# Altium schematic sheet M3005.SchDoc
size A4
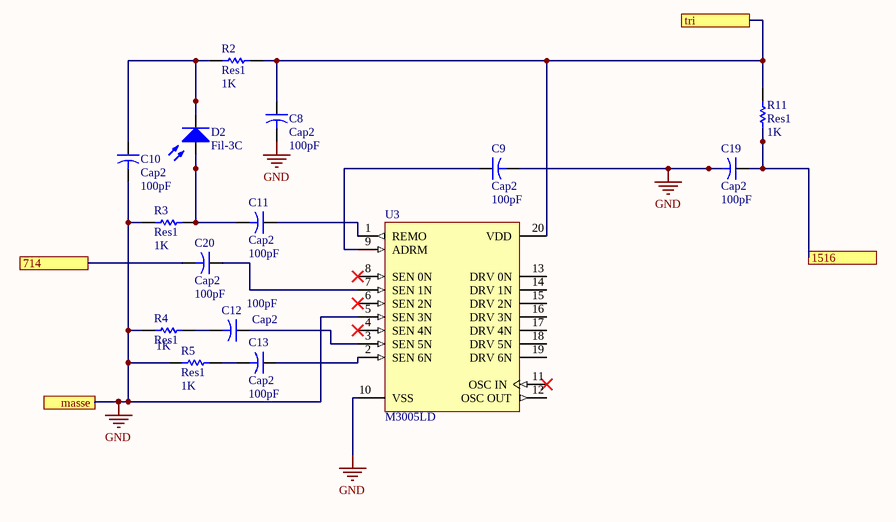
[diagram p0: M3005.SchDoc]

## Parts
C8  Cap2  value 100pF  [RAD-0.2]
C9  Cap2  value 100pF  [RAD-0.2]
C10  Cap2  value 100pF  [RAD-0.2]
C11  Cap2  value 100pF  [RAD-0.2]
C12  Cap2  value 100pF  [RAD-0.2]
C13  Cap2  value 100pF  [RAD-0.2]
C19  Cap2  value 100pF  [RAD-0.2]
C20  Cap2  value 100pF  [RAD-0.2]
D2  Fil-3C  [PIN2]
R2  Res1  value 1K  [AXIAL-0.3]
R3  Res1  value 1K  [AXIAL-0.3]
R4  Res1  value 1K  [AXIAL-0.3]
R5  Res1  value 1K  [AXIAL-0.3]
R11  Res1  value 1K  [AXIAL-0.3]
U3  M3005LD  [SO20_N]

## Ports
714, 1516, masse, tri

## Nets
GND: C8.2 C9.2 C10.2 C19.2 R3.1 R4.1 R5.1 U3.5(SEN_3N) U3.10(VSS) ; port masse
714: C20.2 ; port 714
1516: C19.1 R11.1 ; port 1516
tri: C8.1 R2.1 R11.2 U3.20(VDD) ; port tri
NetC9_1: C9.1 U3.9(ADRM)
NetC10_1: C10.1 D2.2(K) R2.2
NetC11_1: C11.1 U3.1(REMO)
NetC11_2: C11.2 D2.1(A) R3.2
NetC12_1: C12.1 U3.3(SEN_5N)
NetC12_2: C12.2 R4.2
NetC13_1: C13.1 U3.2(SEN_6N)
NetC13_2: C13.2 R5.2
NetC20_1: C20.1 U3.7(SEN_1N)

Not connected (* = marked no-connect by the designer): U3 4(SEN_4N)* 6(SEN_2N)* 8(SEN_0N)* 11(OSC_IN)* 12(OSC_OUT) 13(DRV_0N) 14(DRV_1N) 15(DRV_2N) 16(DRV_3N) 17(DRV_4N) 18(DRV_5N) 19(DRV_6N)

## Library data of the parts
C8-C13 C19 C20 = Cap2: Capacitor; Published: 23-Sep-2002; PackageReference: CAPR5-4X5; Publisher: Altium Limited; PackageDescription: Capacitor; 2 Leads
D2 = Photo Sen: Photosensitive Diode; Published: 24-Mar-1999; LatestRevisionDate: 17-Jul-2002; LatestRevisionNote: Re-released for DXP Platform.; PackageReference: PIN2; Publisher: Altium Limited
R2-R5 R11 = Res1: Resistor; Published: 8-Jun-2000; LatestRevisionDate: 17-Jul-2002; LatestRevisionNote: Re-released for DXP Platform.; PackageReference: AXIAL-0.3; Publisher: Altium Limited; PackageDescription: Axial Device, Thru-Hole; 2 Leads; 0.3 in Pin Spacing
U3 = M3005LD: Remote Control Transmitter; Published: 24-Aug-2001; LatestRevisionDate: 13-Apr-2006; LatestRevisionNote: IPC-7351 Footprint Added.; DatasheetVersion: Jun-1992; PackageVersion: Jul-2001; PackageReference: SO20; Publisher: Altium Limited; PackageDescription: 20-Pin Plastic Small Outline Integrated Circuit 1.27 mm Pitch; Code_JEDEC: MS-013-AC; Code_IPC: SOIC127P1030-20; ComponentLink1Description: Manufacturer Link; ComponentLink1URL: http://www.st.com/